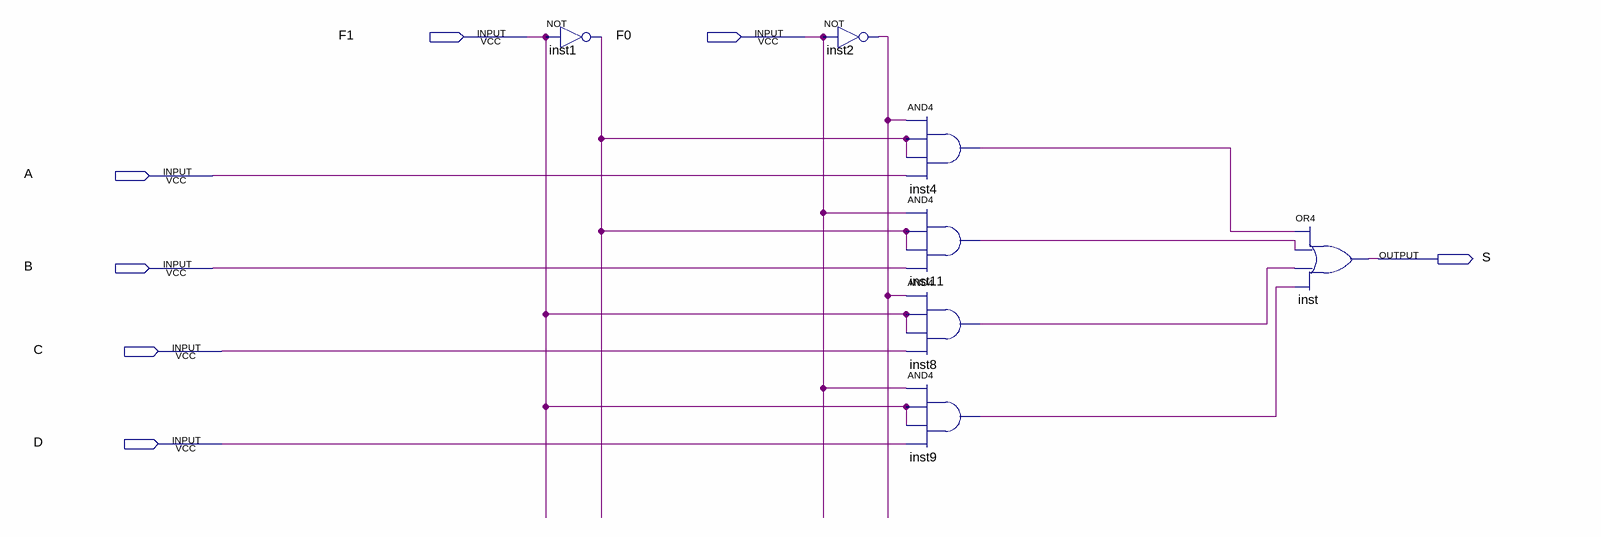
[diagram p0: schematic sheet]
// Quartus schematic MUX4.bdf as structural Verilog: 7 symbols, 7 pins
module MUX4 (
  input  F1,
  input  F0,
  input  A,
  input  B,
  input  C,
  input  D,
  output S
);

  wire inst1_out, inst2_out, inst4_out, inst8_out, inst9_out, inst11_out;

  not inst1 (inst1_out, F1);
  not inst2 (inst2_out, F0);
  and inst4 (inst4_out, inst2_out, inst1_out, inst1_out, A);
  and inst11 (inst11_out, F0, inst1_out, inst1_out, B);
  and inst8 (inst8_out, inst2_out, F1, F1, C);
  and inst9 (inst9_out, F0, F1, F1, D);
  or inst (S, inst4_out, inst11_out, inst8_out, inst9_out);
endmodule
